# EasyEDA Pro project ProDoc_PSM_2025-08-30.epro, schematic PSM_SCH
Board Name: PSM; Create Date: 2025-08-29; Page Name: P1; Project Name: ICM module; Schematic Name: PSM_SCH; Update Date: 2025-08-30; Company: EasyEDA.com; Page Size: A4; Version: V1.0
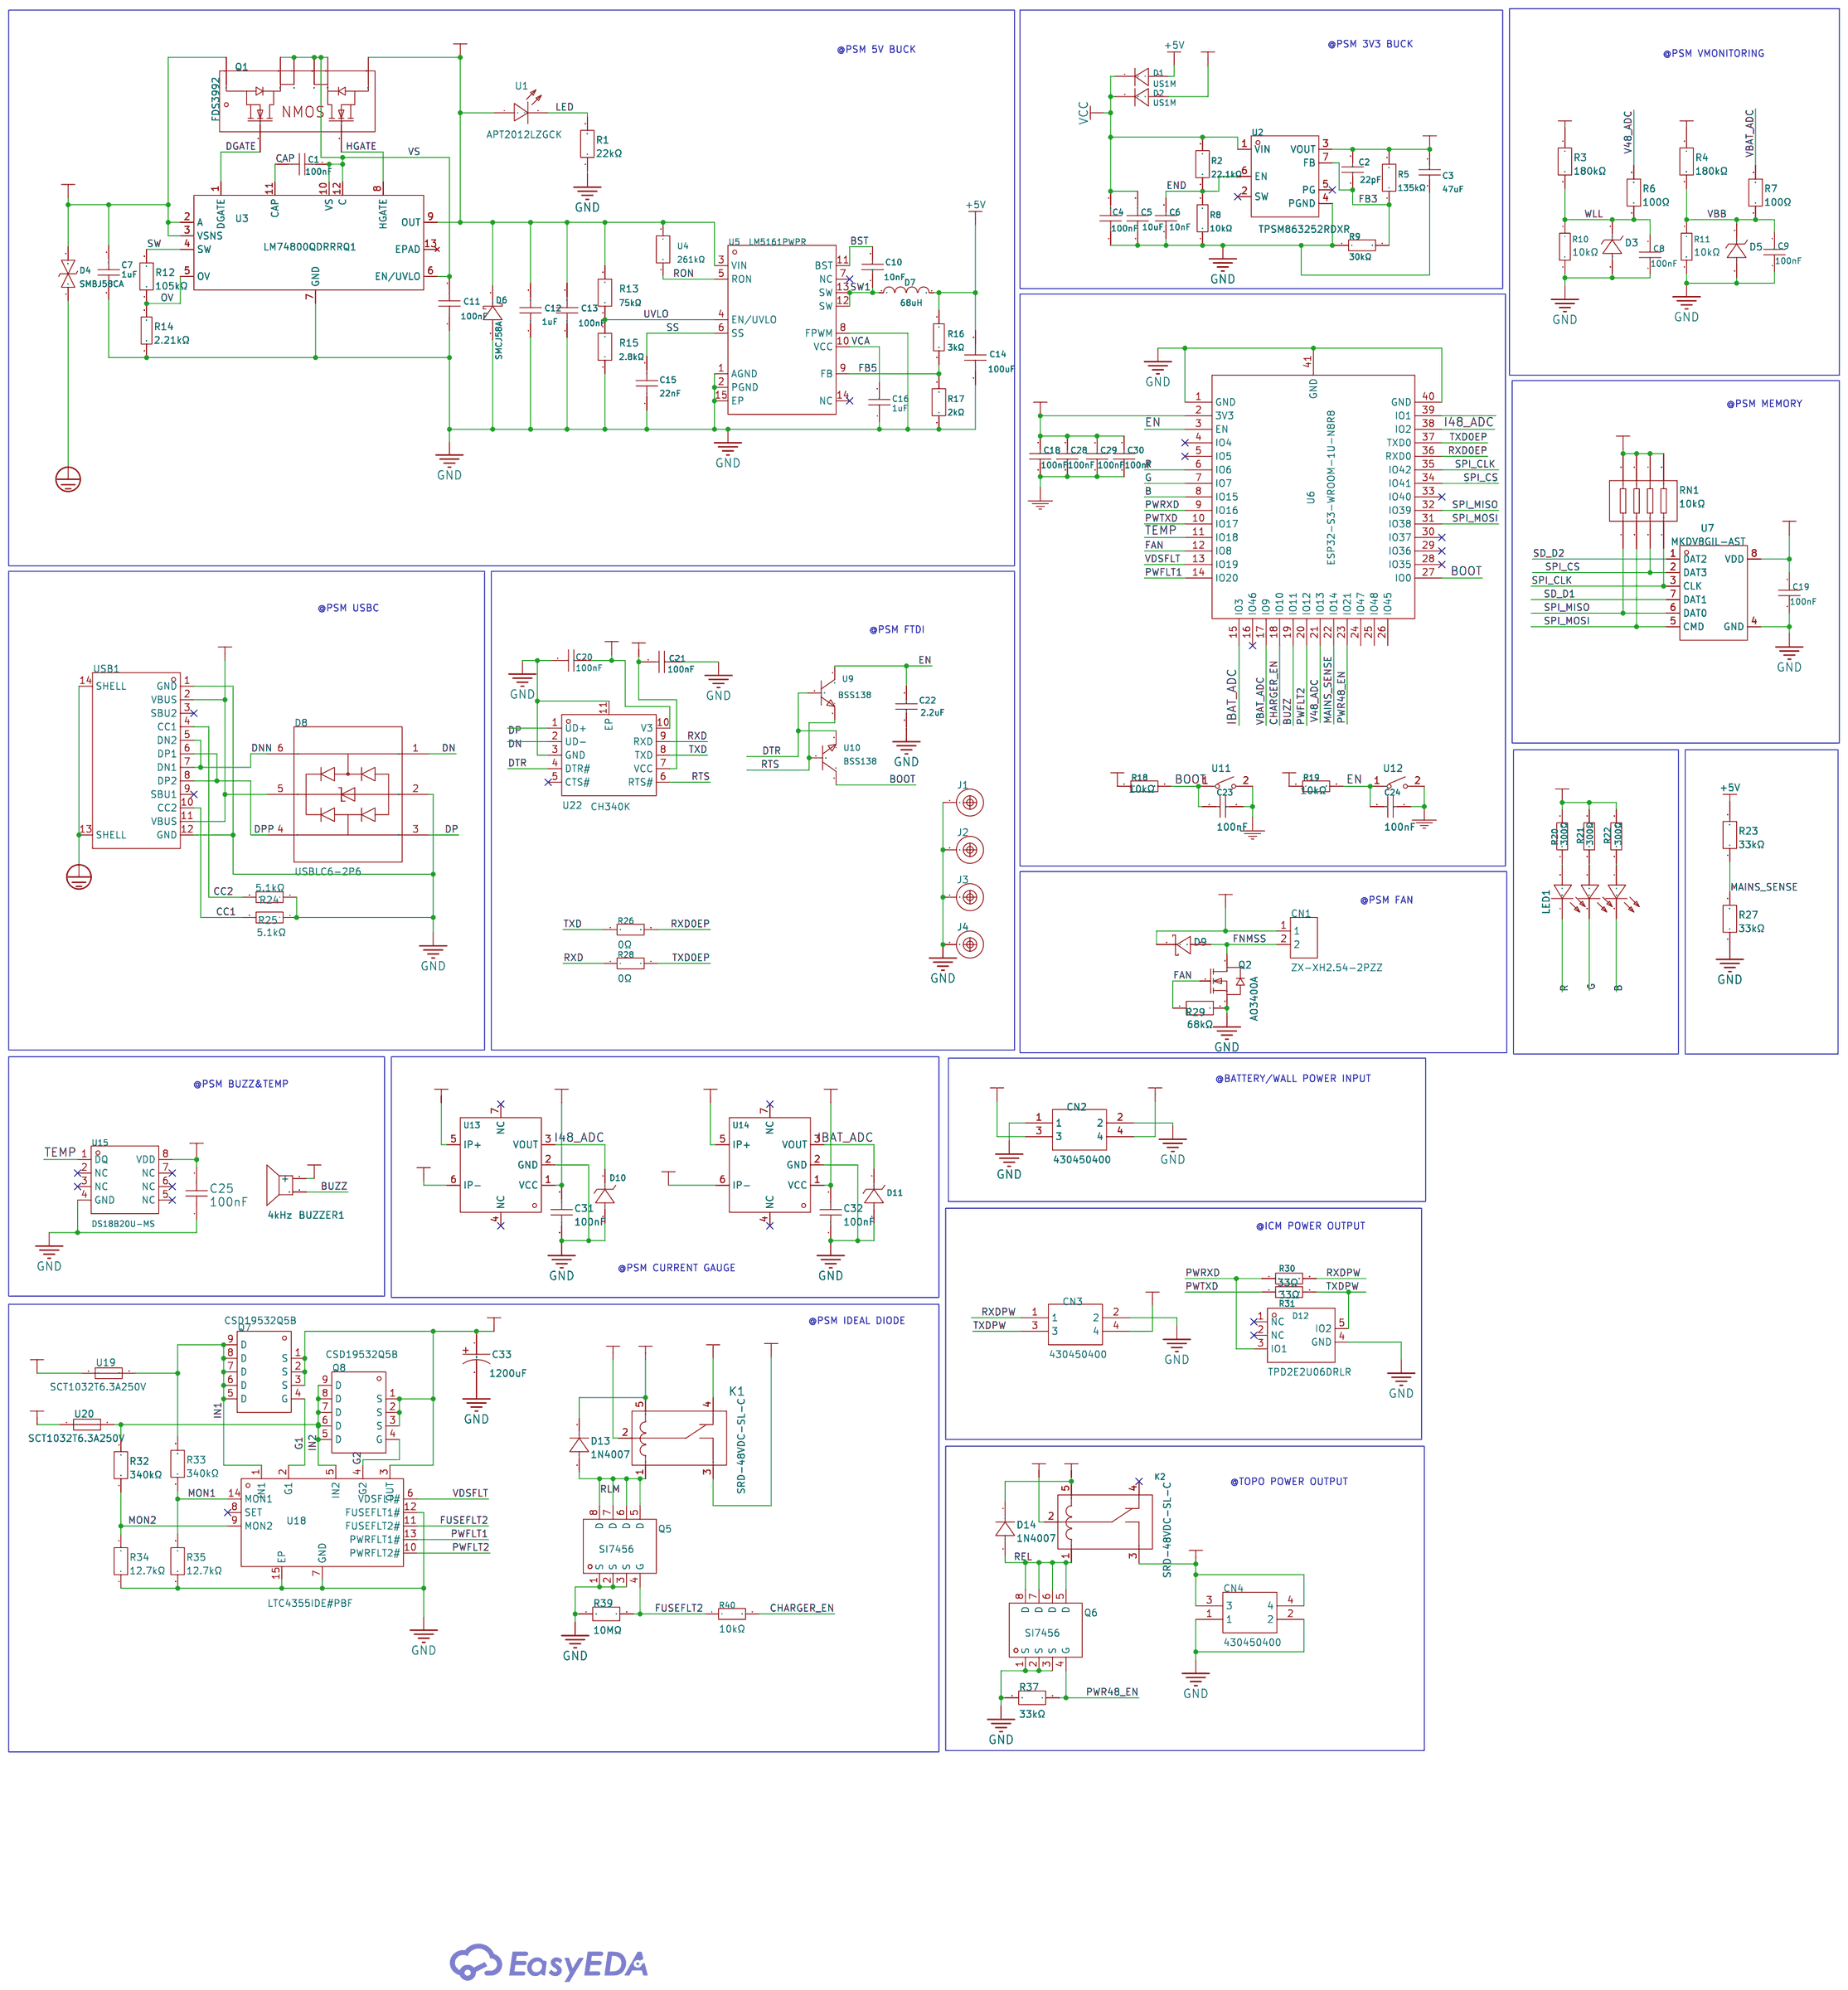
[diagram p0: schematic sheet]

## Parts
BUZZER1  4kHz  [BUZ-TH_PKM13EPYH4002-B0]
C1  100nF  [C1210]
C2  22pF  [C0201]
C3  47uF  [C1210]
C4  100nF  [C0402]
C5  10uF  [C0805]
C6  10nF  [C0201]
C7  1uF  [C2220]
C8  100nF  [C0805]
C9  100nF  [C0805]
C10  10nF  [C0402]
C11  100nF  [C1210]
C12  1uF  [C2220]
C13  100nF  [C1210]
C14  100uF  [C1210]
C15  22nF  [C0805]
C16  1uF  [C0603]
C18  100nF  [C0805]
C19  100nF  [C0805]
C20  100nF  [C0805]
C21  100nF  [C0805]
C22  2.2uF  [C0805]
C23  100nF  [C0805]
C24  100nF  [C0805]
C25  100nF  [C0805]
C28  100nF  [C0805]
C29  100nF  [C0805]
C30  100nF  [C0805]
C31  100nF  [C0805]
C32  100nF  [C0805]
C33  1200uF  [CAP-SMD_BD10.0-L10.3-W10.3-FD-LS11.0]
CN1  ZX-XH2.54-2PZZ  [CONN-TH_2P-P2.50_HX25003-2A]
CN2  430450400  [CONN-TH_0430450400]
CN3  430450400  [CONN-TH_0430450400]
CN4  430450400  [CONN-TH_0430450400]
D1  US1M  [SMA_L4.4-W2.8-LS5.4-RD]
D2  US1M  [SMA_L4.4-W2.8-LS5.4-RD]
D3  MMSZ5232B  [SOD-123_L2.7-W1.6-LS3.7-RD]
D4  SMBJ58CA  [SMB_L4.6-W3.6-LS5.3-BI]
D5  MMSZ5232B  [SOD-123_L2.7-W1.6-LS3.7-RD]
D6  SMCJ58A  [SMC_L6.9-W5.8-LS7.9-RD]
D7  68uH  [IND-SMD_L12.5-W12.5-SRR1280-150M]
D8  USBLC6-2P6  [SOT-666-6_L1.6-W1.2-P0.50-LS1.6-BR]
D9  BAT46WJ,115  [SOD-323F_L2.0-W1.6-LS2.5-RD]
D10  1SMA4728A  [SMA_L4.3-W2.6-LS5.0-RD]
D11  1SMA4728A  [SMA_L4.3-W2.6-LS5.0-RD]
D12  TPD2E2U06DRLR  [SOT-553-5_L1.6-W1.2-P0.50-LS1.6-TL-1]
D13  1N4007  [SMA_L4.3-W2.5-LS5.0-RD]
D14  1N4007  [SMA_L4.3-W2.5-LS5.0-RD]
J1  SCREW-MOUNTING-HOLE-3MM  [MountingHole:MountingHole_2.7mm_M2.5_Pad_Via]
J2  SCREW-MOUNTING-HOLE-3MM  [MountingHole:MountingHole_2.7mm_M2.5_Pad_Via]
J3  SCREW-MOUNTING-HOLE-3MM  [MountingHole:MountingHole_2.7mm_M2.5_Pad_Via]
J4  SCREW-MOUNTING-HOLE-3MM  [MountingHole:MountingHole_2.7mm_M2.5_Pad_Via]
K1  SRD-48VDC-SL-C  [RELAY-TH_SRD-48VDC-SL-C]
K2  SRD-48VDC-SL-C  [RELAY-TH_SRD-48VDC-SL-C]
LED1  HL-AF-5060H271BU46FU79GC-S1-THL  [LED-ARRAY-SMD_6P-L5.4-W5.0-TL-FD]
Q1  FDS3992  [SO-8_L4.9-W3.9-P1.27-LS5.9-BL]
Q2  AO3400A  [SOT-23-3_L2.9-W1.6-P1.90-LS2.8-BR]
Q5  SI7456  [POWERPAK-SO-8_L5.9-W4.9-P1.27-LS6.2-BL]
Q6  SI7456  [POWERPAK-SO-8_L5.9-W4.9-P1.27-LS6.2-BL]
Q7  CSD19532Q5B  [SON-8_L5.0-W6.0-P1.27-BL-1]
Q8  CSD19532Q5B  [SON-8_L5.0-W6.0-P1.27-BL-1]
R1  22kΩ  [R1210]
R2  22.1kΩ  [R0402]
R3  180kΩ  [R1206]
R4  180kΩ  [R1206]
R5  135kΩ  [R0603]
R6  100Ω  [R1206]
R7  100Ω  [R1206]
R8  10kΩ  [R0402]
R9  30kΩ  [R0603]
R10  10kΩ  [R1206]
R11  10kΩ  [R1206]
R12  105kΩ  [R1206]
R13  75kΩ  [R1210]
R14  2.21kΩ  [R1206]
R15  2.8kΩ  [R1210]
R16  3kΩ  [R0603]
R17  2kΩ  [R0402]
R18  10kΩ  [R0805]
R19  10kΩ  [R0805]
R20  300Ω  [R0805]
R21  300Ω  [R0805]
R22  300Ω  [R0805]
R23  33kΩ  [R1206]
R24  5.1kΩ  [R0805]
R25  5.1kΩ  [R0805]
R26  0Ω  [R0805]
R27  33kΩ  [R1206]
R28  0Ω  [R0805]
R29  68kΩ  [R1206]
R30  33Ω  [R0805]
R31  33Ω  [R0805]
R32  340kΩ  [R1206]
R33  340kΩ  [R1206]
R34  12.7kΩ  [R1206]
R35  12.7kΩ  [R1206]
R37  33kΩ  [R1206]
R39  10MΩ  [R1206]
R40  10kΩ  [R1206]
RN1  10kΩ  [RES-ARRAY-SMD_0603-8P-L3.2-W1.6-BL]
U1  APT2012LZGCK  [LED-SMD_L2.0-W1.3-R-RD]
U2  TPSM863252RDXR  [QFN-7_L4.0-W3.3_TPSM863257RDXR]
U3  LM74800QDRRRQ1  [WSON-12_L3.0-W3.0-P0.50-TL-EP-2]
U4  261kΩ  [R0402]
U5  LM5161PWPR  [HTSSOP-14_L5.0-W4.4-P0.65-LS6.4-BL-EP3.0]
U6  ESP32-S3-WROOM-1U-N8R8  [WIRELM-SMD_ESP32-S3-WROOM-1U]
U7  MKDV8GIL-AST  [LGA-8_L6.0-W8.0-P1.27-TL]
U9  BSS138  [SOT-23-3_L2.9-W1.6-P1.90-LS2.8-BR]
U10  BSS138  [SOT-23-3_L2.9-W1.6-P1.90-LS2.8-BR]
U11  TD-1183SN-1.7H-250  [KEY-SMD_L3.0-W2.5-LS4.0]
U12  TD-1183SN-1.7H-250  [KEY-SMD_L3.0-W2.5-LS4.0]
U13  ACS781LLRTR-100B-T  [PSOF-7_L6.4-W4.8-BL]
U14  ACS781LLRTR-100B-T  [PSOF-7_L6.4-W4.8-BL]
U15  DS18B20U-MS  [MSOP-8_L3.0-W3.0-P0.65-LS4.9-BL-1]
U18  LTC4355IDE#PBF  [DFN-14_L4.0-W3.0-P0.50-BL-EP]
U19  SCT1032T6.3A250V  [FUSE-SMD_L10.3-W3.3]
U20  SCT1032T6.3A250V  [FUSE-SMD_L10.3-W3.3]
U22  CH340K  [ESOP-10_L4.9-W3.9-P1.00-LS6.2-BL-EP]
USB1  TYPE-C 16PIN 2MD(073)  [USB-C-SMD_TYPE-C-6PIN-2MD-073]

## Library data of the parts
BUZZER1 = PKM13EPYH4002-B0: Driver Circuitry:Passive (external drive) Technology:Piezoelectric Voltage Rating:- Voltage - Supply:±15V Voltage - Supply:±15V Frequency:4kHz Current Consumption:- Sound Pressure Level(SPL):78dB Diameter(φD):12.6mm Length:- Width:- Height:7.4mm Operating; LCSC Part Name: 压电式蜂鸣器; Supplier Part: C128650; Manufacturer: muRata(村田); Supplier Footprint: 插件,D=12.6mm; JLCPCB Part Class: Extended Part; Datasheet: https://atta.szlcsc.com/upload/public/pdf/source/20200305/C492053_735FBBD713E87D0F645D81009B709975.pdf; Supplier: LCSC; Driver Circuitry: Passive (external drive); Technology: Piezoelectric; Voltage - Supply: ±15V; Sound Pressure Level(SPL): 78dB; Diameter(φD): 12.6mm; Height: 7.4mm; Operating Temperature: -40℃~+85℃
C1 C11 C13 = CC1210KKX7RYBB104: Capacitance: Tolerance:±10% Tolerance:±10% Voltage Rated: Temperature Coefficient:; LCSC Part Name: 100nF ±10% 250V; Supplier Part: C527381; Manufacturer: YAGEO(国巨); Supplier Footprint: 1210; JLCPCB Part Class: Extended Part; Datasheet: https://atta.szlcsc.com/upload/public/pdf/source/20200508/C527381_FB64CFF56C74B71B8CBBB2E2D2FF56B0.pdf; Supplier: LCSC; Tolerance: ±10%
C2 = GRM0335C1E220JA01D: Capacitance: Tolerance:±5% Tolerance:±5% Voltage Rated: Temperature Coefficient:; LCSC Part Name: 22pF ±5% 25V; Supplier Part: C76919; Manufacturer: muRata(村田); Supplier Footprint: 0201; JLCPCB Part Class: Extended Part; Datasheet: https://atta.szlcsc.com/upload/public/pdf/source/20180307/C76919_15204090858141407709.pdf; Supplier: LCSC; Tolerance: ±5%
C3 = GRM32ER71A476KE15L: Capacitance: Tolerance:±10% Tolerance:±10% Voltage Rated: Temperature Coefficient:; LCSC Part Name: 47uF ±10% 10V; Supplier Part: C84494; Manufacturer: muRata(村田); Supplier Footprint: 1210; JLCPCB Part Class: Extended Part; Datasheet: https://atta.szlcsc.com/upload/public/pdf/source/20161226/1482720144456.pdf; Supplier: LCSC; Tolerance: ±10%
C4 = GRM155R71A104KA01D: Capacitance: Tolerance:±10% Tolerance:±10% Voltage Rated: Temperature Coefficient:; LCSC Part Name: 100nF ±10% 10V; Supplier Part: C71687; Manufacturer: muRata(村田); Supplier Footprint: 0402; JLCPCB Part Class: Extended Part; Datasheet: https://atta.szlcsc.com/upload/public/pdf/source/20180228/C71687_15198055953951377607.pdf; Supplier: LCSC; Tolerance: ±10%
C5 = C0805C106K8PACTU: Capacitance: Tolerance:±10% Tolerance:±10% Voltage Rated: Temperature Coefficient:; LCSC Part Name: 10uF ±10% 10V; Supplier Part: C2167673; Manufacturer: KEMET(基美); Supplier Footprint: 0805; JLCPCB Part Class: Extended Part; Datasheet: https://atta.szlcsc.com/upload/public/pdf/source/20210601/F69F25D6FEA5EB3D7C122B835EA50B80.pdf; Supplier: LCSC; Tolerance: ±10%
C6 = GRM033R70J103KA01D: Capacitance: Tolerance:±10% Tolerance:±10% Voltage Rated: Temperature Coefficient:; LCSC Part Name: 10nF ±10% 6.3V; Supplier Part: C76940; Manufacturer: muRata(村田); Supplier Footprint: 0201; JLCPCB Part Class: Extended Part; Datasheet: https://atta.szlcsc.com/upload/public/pdf/source/20180307/C76940_15204091030811407728.pdf; Supplier: LCSC; Tolerance: ±10%
C7 C12 = GRM55DR72E105KW01L: Capacitance: Tolerance:±10% Tolerance:±10% Voltage Rated: Temperature Coefficient:; LCSC Part Name: 1uF ±10% 250V; Supplier Part: C489791; Manufacturer: muRata(村田); Supplier Footprint: 2220; JLCPCB Part Class: Extended Part; Datasheet: https://atta.szlcsc.com/upload/public/pdf/source/20200303/C489791_21819A01F8644F985297DAC22D62BF33.pdf; Supplier: LCSC; Tolerance: ±10%
C8 C9 C18-C21 C23 C24 C28-C30 = 0805B104K500NT: Capacitance:100nF Tolerance:±10% Tolerance:±10% Voltage Rated: Temperature Coefficient:; LCSC Part Name: 100nF ±10% 50V; Supplier Part: C38141; Manufacturer: FH(风华); Supplier Footprint: 0805; JLCPCB Part Class: Extended Part; Datasheet: https://atta.szlcsc.com/upload/public/pdf/source/20200305/C486355_26A10D38EF8C2A5C37091D0039909270.pdf; Supplier: LCSC; Tolerance: ±10%
C10 = GRM155R71H103KA88D: Capacitance: Tolerance:±10% Tolerance:±10% Voltage Rated: Temperature Coefficient:; LCSC Part Name: 10nF ±10% 50V; Supplier Part: C77019; Manufacturer: muRata(村田); Supplier Footprint: 0402; JLCPCB Part Class: Extended Part; Datasheet: https://atta.szlcsc.com/upload/public/pdf/source/20180326/C77019_6A3693CE1BCE757D6A8B7C99DAE1B441.pdf; Supplier: LCSC; Tolerance: ±10%
C14 = GRM32ER60J107ME20L_C88154: Capacitance: Tolerance:±20% Tolerance:±20% Voltage Rated: Temperature Coefficient:; LCSC Part Name: 100uF ±20% 6.3V; Supplier Part: C88154; Manufacturer: muRata(村田); Manufacturer Part: GRM32ER60J107ME20L; Supplier Footprint: 1210; JLCPCB Part Class: Extended Part; Datasheet: https://atta.szlcsc.com/upload/public/pdf/source/20170116/1484561244372.pdf; Supplier: LCSC; Tolerance: ±20%
C15 = CC0805KRX7R7BB223: Capacitance: Tolerance:±10% Tolerance:±10% Voltage Rated: Temperature Coefficient:; LCSC Part Name: 22nF ±10% 16V; Supplier Part: C519961; Manufacturer: YAGEO(国巨); Supplier Footprint: 0805; JLCPCB Part Class: Extended Part; Datasheet: https://atta.szlcsc.com/upload/public/pdf/source/20200423/C519961_BCF55CFF7AF7FA8FAC393D5C8451BEF7.pdf; Supplier: LCSC; Tolerance: ±10%
C16 = EMK107B7105KA-T: Capacitance:1uF Tolerance:±10% Tolerance:±10% Voltage Rating:16V Temperature Coefficient:X7R; LCSC Part Name: MSASE168SB7105KTNA01 1uF ±10% 16V; Supplier Part: C92759; Manufacturer: TAIYO YUDEN(太诱); Supplier Footprint: 0603; JLCPCB Part Class: Extended Part; Datasheet: https://item.szlcsc.com/datasheet/EMK107B7105KA-T/93953.html; Supplier: LCSC; Tolerance: ±10%; Voltage Rating: 16V; Temperature Coefficient: X7R
C22 = CL21B225KAFNNNE: Capacitance: Tolerance:±10% Tolerance:±10% Voltage Rated: Temperature Coefficient:; LCSC Part Name: 2.2uF ±10% 25V; Supplier Part: C19110; Manufacturer: SAMSUNG(三星); Supplier Footprint: 0805; JLCPCB Part Class: Extended Part; Datasheet: https://atta.szlcsc.com/upload/public/pdf/source/20160218/1457707763339.pdf; Supplier: LCSC; Tolerance: ±10%
C25 = GCM21BR71H104KA37K: Capacitance:0.1uF Tolerance:±10% Tolerance:±10% Voltage Rating:50V Temperature Coefficient:X7R; LCSC Part Name: 100nF ±10% 50V; Supplier Part: C28233; Manufacturer: muRata(村田); Supplier Footprint: 0805; JLCPCB Part Class: Extended Part; Datasheet: https://atta.szlcsc.com/upload/public/pdf/source/20230811/01F8D1403046F5B0772D3592B1B0BAA0.pdf; Supplier: LCSC; Tolerance: ±10%; Voltage Rating: 50V; Temperature Coefficient: X7R
C31 C32 = CC0805KRX7R9BB104: Capacitance:100nF Tolerance:±10% Tolerance:±10% Voltage Rating:50V Temperature Coefficient:X7R; LCSC Part Name: 100nF ±10% 50V; Supplier Part: C49678; Manufacturer: YAGEO(国巨); Supplier Footprint: 0805; JLCPCB Part Class: Basic Part; Datasheet: https://item.szlcsc.com/datasheet/CC0805KRX7R9BB104/50686.html; Supplier: LCSC; Tolerance: ±10%; Voltage Rating: 50V; Temperature Coefficient: X7R
C33 = OVZ122M0ETR-1008: Capacitance:1200uF Tolerance:±20% Tolerance:±20% Voltage Rating:2.5V Ripple Current:4.45A@100kHz Equivalent Series Resistance(ESR):- Type:- Pin Spacing:- Diameter:10mm Height - Seated (Max):7.7mm Lifetime:2000hrs@105℃ Operating Temperature:-55℃~+105℃ Oper; LCSC Part Name: 1200uF ±20% 2.5V; Supplier Part: C250090; Manufacturer: Lelon(立隆); Supplier Footprint: SMD,D10xL7.7mm; JLCPCB Part Class: Extended Part; Datasheet: https://item.szlcsc.com/datasheet/OVZ122M0ETR-1008/246212.html; Supplier: LCSC; Tolerance: ±20%; Voltage Rating: 2.5V; Ripple Current: 4.45A@100kHz; Diameter: 10mm; Height - Seated (Max): 7.7mm; Lifetime: 2000hrs@105℃; Operating Temperature: -55℃~+105℃
CN1 = ZX-XH2.54-2PZZ: Pins Structure:1x2P Pitch:2.5mm Mounting Type:Through Hole Reference Series:XH Number of Pins:2P Number of Rows:1 Number of PINs Per Row:2 Row Spacing:- Current Rating:3A Contact Material:Brass Contact Plating:Tin Operating Temperature:-25℃~+85℃ Operating; LCSC Part Name: 1x2P 间距:2.5mm 直插 系列:XH; Supplier Part: C7429632; Manufacturer: Megastar(兆星); Supplier Footprint: 插件,P=2.5mm; JLCPCB Part Class: Extended Part; Datasheet: https://item.szlcsc.com/datasheet/ZX-XH2.54-2PZZ/8427549.html; Supplier: LCSC; Pins Structure: 1x2P; Pitch: 2.5mm; Mounting Type: Through Hole; Reference Series: XH; Number of Pins: 2P; Number of Rows: 1; Number of PINs Per Row: 2; Current Rating: 3A; Contact Material: Brass; Contact Plating: Tin; Operating Temperature: -25℃~+85℃; Voltage Rating: 250V; Plastic Material: PA66; Flame Retardant Rating: UL94V-0; Color: White; Z-Height of the Board: 7mm; X-Length of Bottom Edge on Board (Spacing Line): 7.5mm; Y-Width of Bottom Edge on Board: 5.9mm
CN2-CN4 = 430450400_C122413: Pins Structure:2x2P Pitch:3mm Mounting Type:Right Angle Reference Series:Micro-Fit(MX 3.0) Number of Pins:4P Number of Rows:2 Number of PINs Per Row:2 Row Spacing:3mm Current Rating:8.5A Contact Material:Brass Contact Plating:Tin Operating Temperature:-40; LCSC Part Name: 2x2P 间距:3mm 弯插 系列:Micro-Fit(MX 3.0); Supplier Part: C122413; Manufacturer: MOLEX; Supplier Footprint: 弯插,P=3mm; JLCPCB Part Class: Extended Part; Datasheet: https://www.molex.com/content/dam/molex/molex-dot-com/products/automated/en-us/salesdrawingpdf/430/43045/430450400_sd.pdf?inline\; Supplier: LCSC; Pins Structure: 2x2P; Pitch: 3mm; Mounting Type: Right Angle; Reference Series: Micro-Fit(MX 3.0); Number of Pins: 4P; Number of Rows: 2; Number of PINs Per Row: 2; Row Spacing: 3mm; Current Rating: 8.5A; Contact Material: Brass; Contact Plating: Tin; Operating Temperature: -40℃~+105℃; Voltage Rating: 600V; Flame Retardant Rating: UL94V-0; Supplementary Features: Harpoon Contact (Plastic); Color: Black; Z-Height of the Board: 8.77mm; X-Length of Bottom Edge on Board (Spacing Line): 9.65mm; Y-Width of Bottom Edge on Board: 12.24mm
D1 D2 = US1M_C412437: Diode Configuration:Independent Type Forward Voltage (Vf@If):1.65V@1A Reverse Voltage (Vr): Rectified Current: Reverse Leakage Current:5uA@1kV Reverse Recovery Time (trr): Operating Temperature:-55℃~+150℃@(Tj) Operating Temperature:-55℃~+150℃@(Tj); LCSC Part Name: 电压:1kV 电流:1A; Supplier Part: C412437; Manufacturer: MDD(辰达半导体); Supplier Footprint: SMA; JLCPCB Part Class: Basic Part; Datasheet: https://atta.szlcsc.com/upload/public/pdf/source/20240710/67F2BD91F54C3EE0CEC9BDDD003BC3A0.pdf; Supplier: LCSC; Diode Configuration: Independent Type; Forward Voltage (Vf@If): 1.65V@1A; Reverse Leakage Current: 5uA@1kV; Operating Temperature: -55℃~+150℃@(Tj)
D3 D5 = MMSZ5232B_C19077423: Diode Configuration:Independent Zener Voltage(Nom):5.4V Reverse Leakage Current (Ir):5uA@3.0V Zener Voltage(Range):5.32V~5.88V Zener Voltage(Range):5.32V~5.88V Pd - Power Dissipation:500mW Impedance(Zzt):11Ω Operating Junction Temperature Range:-55℃~+150℃; LCSC Part Name: 独立式 耐压:5.4V 电流:5uA@3.0V; Supplier Part: C19077423; Manufacturer: 宏嘉诚; Supplier Footprint: SOD-123; JLCPCB Part Class: Extended Part; Datasheet: https://item.szlcsc.com/datasheet/MMSZ5232B/20275508.html; Supplier: LCSC; Diode Configuration: Independent; Zener Voltage(Nom): 5.4V; Reverse Leakage Current (Ir): 5uA@3.0V; Zener Voltage(Range): 5.32V~5.88V; Pd - Power Dissipation: 500mW; Impedance(Zzt): 11Ω; Operating Junction Temperature Range: -55℃~+150℃
D4 = SMBJ58CA_C440309: Polarity:Bidirectional Reverse Stand-Off Voltage (Vrwm):58V Clamping Voltage:93.6V Peak Pulse Current (Ipp):6.4A Peak Pulse Power Dissipation (Ppp):600W@10/1000us Voltage - Breakdown:64.4V Reverse Leakage Current (Ir):5uA Operating Temperature:-55℃~+150℃; LCSC Part Name: 双向TVS 58V截止 峰值浪涌电流：6.4A; Supplier Part: C440309; Manufacturer: AnBon(安邦); Supplier Footprint: SMB(DO-214AA); JLCPCB Part Class: Extended Part; Datasheet: https://item.szlcsc.com/datasheet/SMBJ58CA/439717.html; Supplier: LCSC; Polarity: Bidirectional; Reverse Stand-Off Voltage (Vrwm): 58V; Clamping Voltage: 93.6V; Peak Pulse Current (Ipp): 6.4A; Peak Pulse Power Dissipation (Ppp): 600W@10/1000us; Voltage - Breakdown: 64.4V; Reverse Leakage Current (Ir): 5uA; Operating Temperature: -55℃~+150℃; Type: TVS
D6 = SMCJ58A_C42371547: Polarity:Unidirectional Reverse Stand-Off Voltage (Vrwm):58V Clamping Voltage:93.6V Peak Pulse Current (Ipp):16.1A Peak Pulse Power Dissipation (Ppp):1.5kW Voltage - Breakdown:71.2V Reverse Leakage Current (Ir):1uA Operating Temperature:-55℃~+150℃ Operati; LCSC Part Name: 1500W 表面贴装瞬态电压抑制器; Supplier Part: C42371547; Manufacturer: 宏嘉诚; Supplier Footprint: SMC(DO-214AB); JLCPCB Part Class: Extended Part; Datasheet: https://item.szlcsc.com/datasheet/SMCJ58A/44252474.html; Supplier: LCSC; Polarity: Unidirectional; Reverse Stand-Off Voltage (Vrwm): 58V; Clamping Voltage: 93.6V; Peak Pulse Current (Ipp): 16.1A; Peak Pulse Power Dissipation (Ppp): 1.5kW; Voltage - Breakdown: 71.2V; Reverse Leakage Current (Ir): 1uA; Operating Temperature: -55℃~+150℃; level of protection: IEC 61000-4-2; Type: TVS
D7 = SRR1260-680M: Inductance:68uH Tolerance:±20% Tolerance:±20% Current Rating:2.1A Current - Saturation(Isat):2.1A DC Resistance(DCR):110mΩ Type:- Ratings:-; LCSC Part Name: 68uH ±20% 2.1A; Supplier Part: C2041353; Manufacturer: BOURNS; Supplier Footprint: SMD,12.5x12.5mm; JLCPCB Part Class: Extended Part; Datasheet: https://item.szlcsc.com/datasheet/SRR1260-680M/2132916.html; Supplier: LCSC; Tolerance: ±20%; Current Rating: 2.1A; Current - Saturation(Isat): 2.1A; DC Resistance(DCR): 110mΩ
D8 = USBLC6-2P6_C15999: polarity:Unidirectional Reverse Stand-Off Voltage (Vrwm):5.25V Maximum Clamping Voltage:17V Peak Pulse Current (Ipp):5A Breakdown Voltage:6V Number of Lines:Dual channel Type:ESD; LCSC Part Name: 单向ESD; Supplier Part: C15999; Manufacturer: ST(意法半导体); Supplier Footprint: SOT-666-6; JLCPCB Part Class: Extended Part; Datasheet: https://atta.szlcsc.com/upload/public/pdf/source/20140724/1457707160627.pdf; Supplier: LCSC; polarity: Unidirectional; Reverse Stand-Off Voltage (Vrwm): 5.25V; Maximum Clamping Voltage: 17V; Peak Pulse Current (Ipp): 5A; Breakdown Voltage: 6V; Number of Lines: Dual channel; Type: ESD
D9 = BAT46WJ,115: Forward Voltage (Vf@If):850mV@250mA Reverse Voltage (Vr):100V Average Rectified Current (Io):250mA Reverse Leakage Current (Ir):9uA@100V; LCSC Part Name: 电压:100V 电流:250mA; Supplier Part: C114696; Manufacturer: Nexperia(安世); Supplier Footprint: SOD-323F; JLCPCB Part Class: Extended Part; Datasheet: https://atta.szlcsc.com/upload/public/pdf/source/20170620/1497944776306.pdf; Supplier: LCSC; Forward Voltage (Vf@If): 850mV@250mA; Reverse Voltage (Vr): 100V; Average Rectified Current (Io): 250mA; Reverse Leakage Current (Ir): 9uA@100V
D10 D11 = 1SMA4728A_C523836: Zener Voltage (Nom):3.3V Reverse Leakage Current (Ir):100uA@1V Power Dissipation:1W; Supplier Part: C523836; Manufacturer: MDD; Supplier Footprint: SMA; JLCPCB Part Class: Extended Part; Datasheet: https://atta.szlcsc.com/upload/public/pdf/source/20230314/D3FB3E27E1B37F88B63DBD3F994A8ACA.pdf; Supplier: LCSC; Zener Voltage (Nom): 3.3V; Reverse Leakage Current (Ir): 100uA@1V; Power Dissipation: 1W
D12 = TPD2E2U06DRLR: Reverse Stand-Off Voltage (Vrwm):5.5V Clamping Voltage:12.4V Peak Pulse Current (Ipp):5.5A@8/20us Peak Pulse Power Dissipation (Ppp):85W@8/20us Voltage - Breakdown:6.5V Reverse Leakage Current (Ir):10nA Number of Channels:2 Operating Temperature:-40℃~+125; Supplier Part: C1972959; Manufacturer: TI(德州仪器); Supplier Footprint: SOT-553-5; JLCPCB Part Class: Extended Part; Datasheet: https://www.ti.com/cn/lit/gpn/tpd2e2u06; Supplier: LCSC; Reverse Stand-Off Voltage (Vrwm): 5.5V; Clamping Voltage: 12.4V; Peak Pulse Current (Ipp): 5.5A@8/20us; Peak Pulse Power Dissipation (Ppp): 85W@8/20us; Voltage - Breakdown: 6.5V; Reverse Leakage Current (Ir): 10nA; Number of Channels: 2; Operating Temperature: -40℃~+125℃; level of protection: IEC 61000-4-5；IEC 61000-4-2; Type: ESD; Junction Capacitance: 1.5pF
D13 D14 = 1N4007_C727081: Diode Configuration:Independent Voltage - Forward(Vf@If):1.1V@1A Voltage - DC Reverse(Vr):1kV Current - Rectified:1A Reverse Leakage Current (Ir):5uA; Supplier Part: C727081; Manufacturer: TWGMC(迪嘉); Supplier Footprint: SMA(DO-214AC); JLCPCB Part Class: Extended Part; Datasheet: https://item.szlcsc.com/datasheet/1N4007/774186.html; Supplier: LCSC; Diode Configuration: Independent; Voltage - Forward(Vf@If): 1.1V@1A; Voltage - DC Reverse(Vr): 1kV; Current - Rectified: 1A; Reverse Leakage Current (Ir): 5uA
J1-J4 = SCREW-MOUNTING-HOLE-3MM
K1 K2 = SRD-48VDC-SL-C: Coil Voltage:48V Contact Form:1 Form C: 1C (SPDT-CO) Number of Pins:5 Contact Rating:- Switching Voltage(Max):250V@AC Coil Rated Power:360mW Switching Current(Max):15A Coil Type:Non-Polarized - Single Coil Coil Resistance:6.4kΩ Contact Resistance:100mΩ Op; LCSC Part Name: 蓝色 单组转换型继电器; Supplier Part: C490149; Manufacturer: 松乐; Supplier Footprint: 插件,15.6x19.2mm; JLCPCB Part Class: Extended Part; Datasheet: https://item.szlcsc.com/datasheet/SRD-48VDC-SL-C/500431.html; Supplier: LCSC; Coil Voltage: 48V; Contact Form: 1 Form C: 1C (SPDT-CO); Number of Pins: 5; Switching Voltage(Max): 250V@AC; Coil Rated Power: 360mW; Switching Current(Max): 15A; Coil Type: Non-Polarized - Single Coil; Coil Resistance: 6.4kΩ; Contact Resistance: 100mΩ; Operate Time: 10ms; Release Time: 10ms
LED1 = HL-AF-5060H271BU46FU79GC-S1-THL: Supplier Part: C219409; Manufacturer: HONGLITRONIC(鸿利光电); Supplier Footprint: SMD5050; JLCPCB Part Class: Extended Part; Datasheet: https://atta.szlcsc.com/upload/public/pdf/source/20180503/C219409_0CFE42153F672A4C05B1C40D14E85291.pdf; Supplier: LCSC
Q1 = FDS3992: Number:2 N-Channel Drain to Source Voltage:100V Current - Continuous Drain(Id):4.5A RDS(on):- Pd - Power Dissipation:2.5W Gate Threshold Voltage (Vgs(th)):2V Gate Charge(Qg):11nC@10V Input Capacitance(Ciss):750pF@25V Reverse Transfer Capacitance (Crss@Vds; LCSC Part Name: 2个N沟道 耐压:100V 电流:4.5A; Supplier Part: C512899; Manufacturer: onsemi(安森美); Supplier Footprint: SO-8; JLCPCB Part Class: Extended Part; Datasheet: https://item.szlcsc.com/datasheet/FDS3992/527575.html; Supplier: LCSC; Number: 2 N-Channel; Drain to Source Voltage: 100V; Current - Continuous Drain(Id): 4.5A; Pd - Power Dissipation: 2.5W; Gate Threshold Voltage (Vgs(th)): 2V; Gate Charge(Qg): 11nC@10V; Input Capacitance(Ciss): 750pF@25V; Reverse Transfer Capacitance (Crss@Vds): 27pF@25V; Operating Temperature: -55℃~+150℃
Q2 = AO3400A_C5379092: Type:1 N-Channel Drain Source Voltage (Vdss): Continuous Drain Current (Id): Drain Source On Resistance (RDS(on)@Vgs,Id):20mΩ@10V,5A Power Dissipation (Pd): Gate Threshold Voltage (Vgs(th)@Id):1.2V@250uA Total Gate Charge (Qg@Vgs):4.1nC@10V Input Capacita; LCSC Part Name: 1个N沟道 耐压:30V 电流:5.8A; Supplier Part: C5379092; Manufacturer: MSKSEMI(美森科); Supplier Footprint: SOT-23-3L; JLCPCB Part Class: Extended Part; Datasheet: https://atta.szlcsc.com/upload/public/pdf/source/20241113/12FF27F8B99F921F6260393F7E001EE2.pdf; Supplier: LCSC; Type: 1 N-Channel; Drain Source On Resistance (RDS(on)@Vgs,Id): 20mΩ@10V,5A; Gate Threshold Voltage (Vgs(th)@Id): 1.2V@250uA; Total Gate Charge (Qg@Vgs): 4.1nC@10V; Input Capacitance (Ciss@Vds): 345pF@25V; Reverse Transfer Capacitance (Crss@Vds): 32pF@25V; Operating Temperature: -55℃~+150℃
Q5 Q6 = SI7456DP-T1-GE3: Type:1 N-channel Drain to Source Voltage:100V Current - Continuous Drain(Id):9.3A RDS(on):0.025Ω@10V,9.3A Pd - Power Dissipation:5.2W Gate Threshold Voltage (Vgs(th)@Id):4V Gate Charge(Qg):44nC@10V Input Capacitance(Ciss@Vds):- Reverse Transfer Capacitanc; LCSC Part Name: 1个N沟道 耐压:100V 电流:9.3A 停产; Supplier Part: C141541; Manufacturer: VISHAY(威世); Supplier Footprint: PowerPAK-SO-8; JLCPCB Part Class: Extended Part; Datasheet: https://atta.szlcsc.com/upload/public/pdf/source/20171123/C141541_15114109284191137536.pdf; Supplier: LCSC; Type: 1 N-channel; Drain to Source Voltage: 100V; Current - Continuous Drain(Id): 9.3A; RDS(on): 0.025Ω@10V,9.3A; Pd - Power Dissipation: 5.2W; Gate Threshold Voltage (Vgs(th)@Id): 4V; Gate Charge(Qg): 44nC@10V; Reverse Transfer Capacitance (Crss@Vds): 8.6pF@50V; Operating Temperature: -55℃~+150℃
Q7 Q8 = CSD19532Q5B: Number:- Drain to Source Voltage:100V Current - Continuous Drain(Id):17A RDS(on):4.6mΩ@6V,17A Pd - Power Dissipation:195W Gate Threshold Voltage (Vgs(th)):2.6V Gate Charge(Qg):48nC@10V Input Capacitance(Ciss):4.81nF@50V Reverse Transfer Capacitance (Crss@; LCSC Part Name: 耐压:100V 电流:17A; Supplier Part: C473333; Manufacturer: TI(德州仪器); Supplier Footprint: SON-8(5x6); JLCPCB Part Class: Extended Part; Datasheet: https://www.ti.com/cn/lit/gpn/csd19532q5b; Supplier: LCSC; Drain to Source Voltage: 100V; Current - Continuous Drain(Id): 17A; RDS(on): 4.6mΩ@6V,17A; Pd - Power Dissipation: 195W; Gate Threshold Voltage (Vgs(th)): 2.6V; Gate Charge(Qg): 48nC@10V; Input Capacitance(Ciss): 4.81nF@50V; Reverse Transfer Capacitance (Crss@Vds): 18pF@50V; Operating Temperature: -55℃~+150℃
R1 = AC1210FR-0722KL: Type:Thick Film Resistor Resistance:22kΩ Tolerance:±1% Tolerance:±1% Power(Watts):500mW Voltage-Supply(Max):200V Temperature Coefficient:±100ppm/℃ Temperature Coefficient:±100ppm/℃ Operating Temperature:-55℃~+155℃ Operating Temperature:-55℃~+155℃; LCSC Part Name: 厚膜电阻 22kΩ ±1% 500mW; Supplier Part: C230119; Manufacturer: YAGEO(国巨); Supplier Footprint: 1210; JLCPCB Part Class: Extended Part; Datasheet: https://atta.szlcsc.com/upload/public/pdf/source/20241120/4D446B3946E6DC27047BD586A1D384B4.pdf; Supplier: LCSC; Type: Thick Film Resistor; Tolerance: ±1%; Power(Watts): 500mW; Voltage-Supply(Max): 200V; Temperature Coefficient: ±100ppm/℃; Operating Temperature: -55℃~+155℃
R2 = CRCW040222K1FKED: Type:Thick Film Resistors Resistance:22.1kΩ Tolerance:±1% Tolerance:±1% Power(Watts):62.5mW Voltage-Supply(Max):50V Temperature Coefficient:±100ppm/℃ Temperature Coefficient:±100ppm/℃ Operating Temperature:-55℃~+155℃ Operating Temperature:-55℃~+155℃; LCSC Part Name: 厚膜电阻 22.1kΩ ±1% 62.5mW; Supplier Part: C844504; Manufacturer: VISHAY(威世); Supplier Footprint: 0402; JLCPCB Part Class: Extended Part; Datasheet: https://atta.szlcsc.com/upload/public/pdf/source/20200927/C844919_23E7F5DF28E9421F105631C5C2D28736.pdf; Supplier: LCSC; Type: Thick Film Resistors; Tolerance: ±1%; Power(Watts): 62.5mW; Voltage-Supply(Max): 50V; Temperature Coefficient: ±100ppm/℃; Operating Temperature: -55℃~+155℃
R3 R4 = FRC1206J184 TS: Type:Thick Film Resistor Resistance:180kΩ Tolerance:±5% Tolerance:±5% Power(Watts):250mW Voltage-Supply(Max):200V Temperature Coefficient:±100ppm/℃ Temperature Coefficient:±100ppm/℃ Operating Temperature:-55℃~+155℃ Operating Temperature:-55℃~+155℃; LCSC Part Name: 180kΩ ±5% 250mW 厚膜电阻; Supplier Part: C2907436; Manufacturer: FOJAN(富捷); Supplier Footprint: 1206; JLCPCB Part Class: Extended Part; Datasheet: https://item.szlcsc.com/datasheet/FRC1206J184%2520TS/3180949.html; Supplier: LCSC; Type: Thick Film Resistor; Tolerance: ±5%; Power(Watts): 250mW; Voltage-Supply(Max): 200V; Temperature Coefficient: ±100ppm/℃; Operating Temperature: -55℃~+155℃
R5 = RT0603BRD07135KL: Type:Thin Film Resistor Resistance: Tolerance:±0.1% Tolerance:±0.1% Power(Watts): Temperature Coefficient:±25ppm/℃ Temperature Coefficient:±25ppm/℃ Operating Temperature Range:-55℃~+155℃ Operating Temperature Range:-55℃~+155℃; LCSC Part Name: 薄膜电阻 135kΩ ±0.1% 100mW; Supplier Part: C861113; Manufacturer: YAGEO(国巨); Supplier Footprint: 0603; JLCPCB Part Class: Extended Part; Datasheet: https://atta.szlcsc.com/upload/public/pdf/source/20200610/C326738_5639A9F1B6EB6E4AE2197577D3456E7F.pdf; Supplier: LCSC; Type: Thin Film Resistor; Tolerance: ±0.1%; Temperature Coefficient: ±25ppm/℃; Operating Temperature Range: -55℃~+155℃
R6 R7 = FRC1206J101 TS: Type:Thick Film Resistor Resistance:100Ω Tolerance:±5% Tolerance:±5% Power(Watts):250mW Voltage-Supply(Max):200V Temperature Coefficient:±100ppm/℃ Temperature Coefficient:±100ppm/℃ Operating Temperature:-55℃~+155℃ Operating Temperature:-55℃~+155℃; LCSC Part Name: 100Ω ±5% 250mW 厚膜电阻; Supplier Part: C2907422; Manufacturer: FOJAN(富捷); Supplier Footprint: 1206; JLCPCB Part Class: Extended Part; Datasheet: https://item.szlcsc.com/datasheet/FRC1206J101%2520TS/3180935.html; Supplier: LCSC; Type: Thick Film Resistor; Tolerance: ±5%; Power(Watts): 250mW; Voltage-Supply(Max): 200V; Temperature Coefficient: ±100ppm/℃; Operating Temperature: -55℃~+155℃
R8 = CRCW040210K0FKED: Type:Thick Film Resistors Resistance:10kΩ Tolerance:±1% Tolerance:±1% Power(Watts):63mW Voltage-Supply(Max):50V Temperature Coefficient:±100ppm/℃ Temperature Coefficient:±100ppm/℃ Operating Temperature:-55℃~+155℃ Operating Temperature:-55℃~+155℃; LCSC Part Name: 厚膜电阻 10kΩ ±1% 63mW; Supplier Part: C71617; Manufacturer: VISHAY(威世); Supplier Footprint: 0402; JLCPCB Part Class: Extended Part; Datasheet: https://atta.szlcsc.com/upload/public/pdf/source/20180420/C190124_A776A444B598E5893D919B5902899056.pdf; Supplier: LCSC; Type: Thick Film Resistors; Tolerance: ±1%; Power(Watts): 63mW; Voltage-Supply(Max): 50V; Temperature Coefficient: ±100ppm/℃; Operating Temperature: -55℃~+155℃
R9 = RC0603FR-0730KL: Type:Thick Film Resistor Resistance:30kΩ Tolerance:±1% Tolerance:±1% Power(Watts):100mW Voltage-Supply(Max):75V Temperature Coefficient:±100ppm/℃ Temperature Coefficient:±100ppm/℃ Operating Temperature:-55℃~+155℃ Operating Temperature:-55℃~+155℃; LCSC Part Name: 厚膜电阻 30kΩ ±1% 100mW; Supplier Part: C100001; Manufacturer: YAGEO(国巨); Supplier Footprint: 0603; JLCPCB Part Class: Extended Part; Datasheet: https://atta.szlcsc.com/upload/public/pdf/source/20250610/89E4D743C004A82A45145C7A2CC3A578.pdf; Supplier: LCSC; Type: Thick Film Resistor; Tolerance: ±1%; Power(Watts): 100mW; Voltage-Supply(Max): 75V; Temperature Coefficient: ±100ppm/℃; Operating Temperature: -55℃~+155℃
R10 R11 R40 = 1206W4F1002T5E: Type:Thick Film Resistor Resistance:10kΩ Tolerance:±1% Tolerance:±1% Power(Watts):250mW Voltage-Supply(Max):200V Temperature Coefficient:±100ppm/℃ Temperature Coefficient:±100ppm/℃ Operating Temperature:-55℃~+155℃ Operating Temperature:-55℃~+155℃; LCSC Part Name: 10kΩ ±1% 250mW 厚膜电阻; Supplier Part: C17902; Manufacturer: UNI-ROYAL(厚声); Supplier Footprint: 1206; JLCPCB Part Class: Basic Part; Datasheet: https://item.szlcsc.com/datasheet/1206W4F1002T5E/18590.html; Supplier: LCSC; Type: Thick Film Resistor; Tolerance: ±1%; Power(Watts): 250mW; Voltage-Supply(Max): 200V; Temperature Coefficient: ±100ppm/℃; Operating Temperature: -55℃~+155℃
R12 = RC1206FR-07105KL: Type:Thick Film Resistor Resistance:105kΩ Tolerance:±1% Tolerance:±1% Power(Watts):250mW Voltage-Supply(Max):200V Temperature Coefficient:±100ppm/℃ Temperature Coefficient:±100ppm/℃ Operating Temperature:-55℃~+155℃ Operating Temperature:-55℃~+155℃; LCSC Part Name: 厚膜电阻 105kΩ ±1% 250mW; Supplier Part: C488616; Manufacturer: YAGEO(国巨); Supplier Footprint: 1206; JLCPCB Part Class: Extended Part; Datasheet: https://atta.szlcsc.com/upload/public/pdf/source/20250610/89E4D743C004A82A45145C7A2CC3A578.pdf; Supplier: LCSC; Type: Thick Film Resistor; Tolerance: ±1%; Power(Watts): 250mW; Voltage-Supply(Max): 200V; Temperature Coefficient: ±100ppm/℃; Operating Temperature: -55℃~+155℃
R13 = AC1210FR-0775KL: Type:Thick Film Resistors Resistance: Tolerance:±1% Tolerance:±1% Power(Watts): Overload Voltage (Max): Temperature Coefficient:±100ppm/℃ Temperature Coefficient:±100ppm/℃ Operating Temperature Range:-55℃~+155℃ Operating Temperature Range:-55℃~+155℃; LCSC Part Name: 厚膜电阻 75kΩ ±1% 500mW; Supplier Part: C230340; Manufacturer: YAGEO(国巨); Supplier Footprint: 1210; JLCPCB Part Class: Extended Part; Datasheet: https://atta.szlcsc.com/upload/public/pdf/source/20191108/C230504_7FB43CAE7E86B3B2980C2491161B254C.pdf; Supplier: LCSC; Type: Thick Film Resistors; Tolerance: ±1%; Temperature Coefficient: ±100ppm/℃; Operating Temperature Range: -55℃~+155℃
R14 = AC1206FR-072K21L: Type:Thick Film Resistors Resistance: Tolerance:±1% Tolerance:±1% Power(Watts):250mW Overload Voltage (Max): Temperature Coefficient:±100ppm/℃ Temperature Coefficient:±100ppm/℃ Operating Temperature Range:-55℃~+155℃ Operating Temperature Range:-55℃~+155℃; LCSC Part Name: 厚膜电阻 2.21kΩ ±1% 250mW; Supplier Part: C229508; Manufacturer: YAGEO(国巨); Supplier Footprint: 1206; JLCPCB Part Class: Extended Part; Datasheet: https://atta.szlcsc.com/upload/public/pdf/source/20180927/C229861_4ABDC471507C1ED6AFB4BA66AFC8620A.pdf; Supplier: LCSC; Type: Thick Film Resistors; Tolerance: ±1%; Power(Watts): 250mW; Temperature Coefficient: ±100ppm/℃; Operating Temperature Range: -55℃~+155℃
R15 = AC1210FR-072K8L: Type:Thick Film Resistors Resistance: Tolerance:±1% Tolerance:±1% Power(Watts): Overload Voltage (Max): Temperature Coefficient:±100ppm/℃ Temperature Coefficient:±100ppm/℃ Operating Temperature Range:-55℃~+155℃ Operating Temperature Range:-55℃~+155℃; LCSC Part Name: 厚膜电阻 2.8kΩ ±1% 500mW; Supplier Part: C230171; Manufacturer: YAGEO(国巨); Supplier Footprint: 1210; JLCPCB Part Class: Extended Part; Datasheet: https://atta.szlcsc.com/upload/public/pdf/source/20191108/C230504_7FB43CAE7E86B3B2980C2491161B254C.pdf; Supplier: LCSC; Type: Thick Film Resistors; Tolerance: ±1%; Temperature Coefficient: ±100ppm/℃; Operating Temperature Range: -55℃~+155℃
R16 = RC0603FR-073KL: Type:Thick Film Resistors Resistance:3kΩ Tolerance:±1% Tolerance:±1% Power(Watts):100mW Voltage-Supply(Max):75V Temperature Coefficient:±100ppm/℃ Temperature Coefficient:±100ppm/℃ Operating Temperature:-55℃~+155℃ Operating Temperature:-55℃~+155℃; LCSC Part Name: 厚膜电阻 3kΩ ±1% 100mW; Supplier Part: C126358; Manufacturer: YAGEO(国巨); Supplier Footprint: 0603; JLCPCB Part Class: Extended Part; Datasheet: https://atta.szlcsc.com/upload/public/pdf/source/20170914/C127450_1505359406912967677.pdf; Supplier: LCSC; Type: Thick Film Resistors; Tolerance: ±1%; Power(Watts): 100mW; Voltage-Supply(Max): 75V; Temperature Coefficient: ±100ppm/℃; Operating Temperature: -55℃~+155℃
R17 = CRCW04022K00FKED: Type:Thick Film Resistors Resistance: Tolerance:±1% Tolerance:±1% Power(Watts): Overload Voltage (Max): Temperature Coefficient:±100ppm/℃ Temperature Coefficient:±100ppm/℃ Operating Temperature Range:-55℃~+155℃ Operating Temperature Range:-55℃~+155℃; LCSC Part Name: 厚膜电阻 2kΩ ±1% 62.5mW; Supplier Part: C482125; Manufacturer: VISHAY(威世); Supplier Footprint: 0402; JLCPCB Part Class: Extended Part; Datasheet: https://atta.szlcsc.com/upload/public/pdf/source/20200618/C481956_E25174B008CE8C884BEDD7D4D15E674F.pdf; Supplier: LCSC; Type: Thick Film Resistors; Tolerance: ±1%; Temperature Coefficient: ±100ppm/℃; Operating Temperature Range: -55℃~+155℃
R18 R19 = 0805W8F1002T5E: Type:Thick Film Resistors Resistance:10kΩ Tolerance:±1% Tolerance:±1% Power(Watts): Overload Voltage (Max): Temperature Coefficient:±100ppm/℃ Temperature Coefficient:±100ppm/℃ Operating Temperature Range:-55℃~+155℃ Operating Temperature Range:-55℃~+155℃; LCSC Part Name: 10kΩ ±1% 125mW 厚膜电阻; Supplier Part: C17414; Manufacturer: UNI-ROYAL(厚声); Supplier Footprint: 0805; JLCPCB Part Class: Basic Part; Datasheet: https://atta.szlcsc.com/upload/public/pdf/source/20200306/C422600_1E6D84923E4A46A82E41ADD87F860B5C.pdf; Supplier: LCSC; Type: Thick Film Resistors; Tolerance: ±1%; Temperature Coefficient: ±100ppm/℃; Operating Temperature Range: -55℃~+155℃
R20-R22 = 0805W8F3000T5E: Type:Thick Film Resistor Resistance:300Ω Tolerance:±1% Tolerance:±1% Power(Watts):125mW Voltage-Supply(Max):150V Temperature Coefficient:±100ppm/℃ Temperature Coefficient:±100ppm/℃ Operating Temperature:-55℃~+155℃ Operating Temperature:-55℃~+155℃; LCSC Part Name: 300Ω ±1% 125mW 厚膜电阻; Supplier Part: C17617; Manufacturer: UNI-ROYAL(厚声); Supplier Footprint: 0805; JLCPCB Part Class: Basic Part; Datasheet: https://item.szlcsc.com/datasheet/0805W8F3000T5E/18305.html; Supplier: LCSC; Type: Thick Film Resistor; Tolerance: ±1%; Power(Watts): 125mW; Voltage-Supply(Max): 150V; Temperature Coefficient: ±100ppm/℃; Operating Temperature: -55℃~+155℃
R23 R27 R37 = FRC1206F3302TS: Type:Thick Film Resistor Resistance:33kΩ Tolerance:±1% Tolerance:±1% Power(Watts):250mW Voltage-Supply(Max):200V Temperature Coefficient:±100ppm/℃ Temperature Coefficient:±100ppm/℃ Operating Temperature:-55℃~+155℃ Operating Temperature:-55℃~+155℃; LCSC Part Name: 33kΩ ±1% 250mW 厚膜电阻; Supplier Part: C2933676; Manufacturer: FOJAN(富捷); Supplier Footprint: 1206; JLCPCB Part Class: Extended Part; Datasheet: https://item.szlcsc.com/datasheet/FRC1206F3302TS/3279778.html; Supplier: LCSC; Type: Thick Film Resistor; Tolerance: ±1%; Power(Watts): 250mW; Voltage-Supply(Max): 200V; Temperature Coefficient: ±100ppm/℃; Operating Temperature: -55℃~+155℃
R24 R25 = 0805W8F5101T5E: Type:Thick Film Resistor Resistance:5.1kΩ Tolerance:±1% Tolerance:±1% Power(Watts):125mW Voltage-Supply(Max):150V Temperature Coefficient:±100ppm/℃ Temperature Coefficient:±100ppm/℃ Operating Temperature:-55℃~+155℃ Operating Temperature:-55℃~+155℃; LCSC Part Name: 5.1kΩ ±1% 125mW 厚膜电阻; Supplier Part: C27834; Manufacturer: UNI-ROYAL(厚声); Supplier Footprint: 0805; JLCPCB Part Class: Basic Part; Datasheet: https://item.szlcsc.com/datasheet/0805W8F5101T5E/28584.html; Supplier: LCSC; Type: Thick Film Resistor; Tolerance: ±1%; Power(Watts): 125mW; Voltage-Supply(Max): 150V; Temperature Coefficient: ±100ppm/℃; Operating Temperature: -55℃~+155℃
R26 R28 = 0805W8F0000T5E_C17477: Type:Thick Film Resistors Resistance: Tolerance:±1% Tolerance:±1% Power(Watts): Overload Voltage (Max): Temperature Coefficient:±800ppm/℃ Temperature Coefficient:±800ppm/℃ Operating Temperature Range:-55℃~+155℃ Operating Temperature Range:-55℃~+155℃; LCSC Part Name: 0Ω ±1% 125mW 厚膜电阻; Supplier Part: C17477; Manufacturer: UNI-ROYAL(厚声); Manufacturer Part: 0805W8F0000T5E; Supplier Footprint: 0805; JLCPCB Part Class: Basic Part; Datasheet: https://atta.szlcsc.com/upload/public/pdf/source/20200306/C422600_1E6D84923E4A46A82E41ADD87F860B5C.pdf; Supplier: LCSC; Type: Thick Film Resistors; Tolerance: ±1%; Temperature Coefficient: ±800ppm/℃; Operating Temperature Range: -55℃~+155℃
R29 = RT1206BRD0768KL: Type:Thin Film Resistor Resistance: Tolerance:±0.1% Tolerance:±0.1% Power(Watts):250mW Overload Voltage (Max): Temperature Coefficient:±25ppm/℃ Temperature Coefficient:±25ppm/℃ Operating Temperature Range:-55℃~+155℃ Operating Temperature Range:-55℃~+155℃; LCSC Part Name: 薄膜电阻 68kΩ ±0.1% 250mW; Supplier Part: C706422; Manufacturer: YAGEO(国巨); Supplier Footprint: 1206; JLCPCB Part Class: Extended Part; Datasheet: https://atta.szlcsc.com/upload/public/pdf/source/20200720/C706422_759B829B0D18A4900E8B43DA140C33CB.pdf; Supplier: LCSC; Type: Thin Film Resistor; Tolerance: ±0.1%; Power(Watts): 250mW; Temperature Coefficient: ±25ppm/℃; Operating Temperature Range: -55℃~+155℃
R30 R31 = 0805W8F330JT5E: Type:Thick Film Resistor Resistance:33Ω Tolerance:±1% Tolerance:±1% Power(Watts):125mW Voltage-Supply(Max):150V Temperature Coefficient:±200ppm/℃ Temperature Coefficient:±200ppm/℃ Operating Temperature:-55℃~+155℃ Operating Temperature:-55℃~+155℃; LCSC Part Name: 33Ω ±1% 125mW 厚膜电阻; Supplier Part: C17634; Manufacturer: UNI-ROYAL(厚声); Supplier Footprint: 0805; JLCPCB Part Class: Basic Part; Datasheet: https://item.szlcsc.com/datasheet/0805W8F330JT5E/18322.html; Supplier: LCSC; Type: Thick Film Resistor; Tolerance: ±1%; Power(Watts): 125mW; Voltage-Supply(Max): 150V; Temperature Coefficient: ±200ppm/℃; Operating Temperature: -55℃~+155℃
R32 R33 = ARG06DTC3403: Type:Thin Film Resistor Resistance:340kΩ Tolerance:±0.5% Tolerance:±0.5% Power(Watts):250mW Voltage-Supply(Max):200V Temperature Coefficient:±25ppm/℃ Temperature Coefficient:±25ppm/℃ Operating Temperature:-55℃~+155℃ Operating Temperature:-55℃~+155℃; LCSC Part Name: 薄膜电阻 340kΩ ±0.5% 250mW; Supplier Part: C5137142; Manufacturer: Viking(光颉); Supplier Footprint: 1206; JLCPCB Part Class: Extended Part; Datasheet: https://item.szlcsc.com/datasheet/ARG06DTC3403/5745805.html; Supplier: LCSC; Type: Thin Film Resistor; Tolerance: ±0.5%; Power(Watts): 250mW; Voltage-Supply(Max): 200V; Temperature Coefficient: ±25ppm/℃; Operating Temperature: -55℃~+155℃
R34 R35 = SCR1206F12K7: Type:Thick Film Resistor Resistance:12.7kΩ Tolerance:±1% Tolerance:±1% Power(Watts):250mW Voltage-Supply(Max):200V Operating Temperature:-55℃~+155℃ Operating Temperature:-55℃~+155℃; LCSC Part Name: 厚膜电阻 12.7kΩ ±1% 250mW; Supplier Part: C3017315; Manufacturer: VO(翔胜); Supplier Footprint: 1206; JLCPCB Part Class: Extended Part; Datasheet: https://atta.szlcsc.com/upload/public/pdf/source/20220513/247AF9639BA21CF93567DC289CCC6A22.pdf; Supplier: LCSC; Type: Thick Film Resistor; Tolerance: ±1%; Power(Watts): 250mW; Voltage-Supply(Max): 200V; Operating Temperature: -55℃~+155℃
R39 = FRC1206F1005TS: Type:Thick Film Resistor Resistance:10MΩ Tolerance:±1% Tolerance:±1% Power(Watts):250mW Voltage-Supply(Max):200V Temperature Coefficient:±100ppm/℃ Temperature Coefficient:±100ppm/℃ Operating Temperature:-55℃~+155℃ Operating Temperature:-55℃~+155℃; LCSC Part Name: 10MΩ ±1% 250mW 厚膜电阻; Supplier Part: C2933576; Manufacturer: FOJAN(富捷); Supplier Footprint: 1206; JLCPCB Part Class: Extended Part; Datasheet: https://item.szlcsc.com/datasheet/FRC1206F1005TS/3279678.html; Supplier: LCSC; Type: Thick Film Resistor; Tolerance: ±1%; Power(Watts): 250mW; Voltage-Supply(Max): 200V; Temperature Coefficient: ±100ppm/℃; Operating Temperature: -55℃~+155℃
RN1 = 4D03WGJ0103T5E: Number of Resistors: Resistance:10kΩ Tolerance:±5% Tolerance:±5% Power(Watts): Temperature Coefficient:±200ppm/℃ Temperature Coefficient:±200ppm/℃ Number of Pins:; LCSC Part Name: 10kΩ ±5%; Supplier Part: C29718; Manufacturer: UNI-ROYAL(厚声); Supplier Footprint: 0603x4; JLCPCB Part Class: Basic Part; Datasheet: https://atta.szlcsc.com/upload/public/pdf/source/20191224/C474318_2527498AE30E813171187CCD28401A71.pdf; Supplier: LCSC; Tolerance: ±5%; Temperature Coefficient: ±200ppm/℃
U1 = APT2012LZGCK: Illumination Color:Emerald Green Voltage - Forward(Vf):2.65V Voltage - Forward(Vf):2.65V Forward Current:2mA Wavelength - Dominant:525nm Wavelength - Dominant:525nm Peak Wavelength:515nm Lens Color:Water Clear Luminous Intensity:50mcd Luminous Intensity:5; Supplier Part: C5569446; Manufacturer: Kingbright; Supplier Footprint: 0805; JLCPCB Part Class: Extended Part; Datasheet: https://item.szlcsc.com/datasheet/APT2012LZGCK/6487820.html; Supplier: LCSC; Illumination Color: Emerald Green; Voltage - Forward(Vf): 2.65V; Forward Current: 2mA; Wavelength - Dominant: 525nm; Peak Wavelength: 515nm; Lens Color: Water Clear; Luminous Intensity: 50mcd
U2 = TPSM863252RDXR: Function:Buck Number of Outputs:1 Voltage - Supply:3V~17V Voltage - Supply:3V~17V Output Voltage Accuracy:±1.5% Output Voltage Accuracy:±1.5% Output Voltage:600mV~10V Output Voltage:600mV~10V Output Current(Max):3A Output Current(Max):3A Supply Current (I; Supplier Part: C19632640; Manufacturer: TI(德州仪器); Supplier Footprint: QFN-FCMOD-7(3.3x4); JLCPCB Part Class: Extended Part; Datasheet: https://www.ti.com.cn/cn/lit/ds/symlink/tpsm863252.pdf?ts=1738739465848&ref_url=https%253A%252F%252Fwww.ti.com.cn%252Fsitesearch%252Fzh-cn%252Fdocs%252Funiversalsearch.tsp%253FlangPref%253Dzh-CN%2526nr%253D12%2526searchTerm%253DTPSM863252RDXR; Supplier: LCSC; Function: Buck; Number of Outputs: 1; Voltage - Supply: 3V~17V; Output Voltage Accuracy: ±1.5%; Output Voltage: 600mV~10V; Output Current(Max): 3A; Supply Current (Iq): 100uA; Switching Frequency: 1.2MHz; Ripple Noise: 20mVp-p; Features: Over Current Protection；Over Voltage Protection；Under Voltage Protection；Over Temperature Protection; Length: 4mm; Width: 3.3mm; Height: 2mm; Operating Temperature Range: -40℃~+125℃
U3 = LM74800QDRRRQ1: Maximum Continuous Current:2.6A Voltage - Supply:3V~65V Voltage - Supply:3V~65V Operating Temperature	-:-40℃~+125℃ Operating Temperature	-:-40℃~+125℃; Supplier Part: C3215600; Manufacturer: TI(德州仪器); Supplier Footprint: SON-12(3x3); JLCPCB Part Class: Extended Part; Datasheet: https://www.ti.com/cn/lit/gpn/lm7480-q1; Supplier: LCSC; Maximum Continuous Current: 2.6A; Voltage - Supply: 3V~65V; Operating Temperature	-: -40℃~+125℃
U4 = CRCW0402261KFKED: Type:Thick Film Resistors Resistance: Tolerance:±1% Tolerance:±1% Power(Watts): Overload Voltage (Max): Temperature Coefficient:±100ppm/℃ Temperature Coefficient:±100ppm/℃ Operating Temperature:-55℃~+155℃ Operating Temperature:-55℃~+155℃; LCSC Part Name: 厚膜电阻 261kΩ ±1% 62.5mW; Supplier Part: C2076807; Manufacturer: VISHAY(威世); Supplier Footprint: 0402; JLCPCB Part Class: Extended Part; Datasheet: https://atta.szlcsc.com/upload/public/pdf/source/20210503/4CAD3FA9B4C9A749933C1C52DBF827C2.pdf; Supplier: LCSC; Type: Thick Film Resistors; Tolerance: ±1%; Temperature Coefficient: ±100ppm/℃; Operating Temperature: -55℃~+155℃
U5 = LM5161PWPR: Function:Step-down type Output Type:Adjustable Input Voltage:4.5V~100V Input Voltage:4.5V~100V Output Voltage:2V~92V Output Voltage:2V~92V Output Current:1A Switching Frequency:1MHz Switching Frequency:1MHz Operating Temperature:-40℃~+125℃@(TJ) Operating; LCSC Part Name: 100V 1A 同步降压转换器; Supplier Part: C468246; Manufacturer: TI(德州仪器); Supplier Footprint: HTSSOP-14-EP; JLCPCB Part Class: Extended Part; Datasheet: https://www.ti.com/cn/lit/gpn/lm5161; Supplier: LCSC; Function: Step-down type; Output Type: Adjustable; Input Voltage: 4.5V~100V; Output Voltage: 2V~92V; Output Current: 1A; Switching Frequency: 1MHz; Operating Temperature: -40℃~+125℃@(TJ); Synchronous Rectification: Yes; Number of Outputs: 1; Topology: Step-down；Flyback; Switch tube (built-in/external): Built-in
U6 = ESP32-S3-WROOM-1U-N8R8: LCSC Part Name: 通用型Wi-Fi+低功耗蓝牙MCU模组; Supplier Part: C2980300; Manufacturer: ESPRESSIF(乐鑫); Supplier Footprint: SMD,18x19.2mm; JLCPCB Part Class: Extended Part; Datasheet: https://item.szlcsc.com/datasheet/ESP32-S3-WROOM-1U-N8R8/3401552.html; Supplier: LCSC
U7 = MKDV8GIL-AST: Memory Size:8Gbit Clock Frequency:50MHz Voltage - Supply:2.7V~3.6V Voltage - Supply:2.7V~3.6V Write Cycle Time(tWC):- Page Program time (TPP):- Block Erase Time(tBE):- Data Retention - TDR (Year):- Operating Temperature:-40℃~+85℃ Operating Temperature:-40; LCSC Part Name: 8Gb SD NAND  SDNAND工业级宽温 SLC; Supplier Part: C26159627; Manufacturer: MK(米客方德); Supplier Footprint: LGA-8(6x8); JLCPCB Part Class: Extended Part; Datasheet: https://atta.szlcsc.com/upload/public/pdf/source/20240705/6522E9CE94E018BF06A2CACAEEC15C56.pdf; Supplier: LCSC; Memory Size: 8Gbit; Clock Frequency: 50MHz; Voltage - Supply: 2.7V~3.6V; Operating Temperature: -40℃~+85℃; Interface: SD2.0
U9 U10 = BSS138_C5250986: Supplier Part: C5250986; Manufacturer: TWGMC(台湾迪嘉); Supplier Footprint: SOT-23; JLCPCB Part Class: Extended Part; Datasheet: https://atta.szlcsc.com/upload/public/pdf/source/20221109/9ADA114E38717C662A3131D5642C5082.pdf; Supplier: LCSC
U11 U12 = TD-1183SN-1.7H-250: LCSC Part Name: 小型正按轻触开关无柱 250gf H1.8; Supplier Part: C2905195; Manufacturer: DEALON(德艺隆); Supplier Footprint: SMD,2.5x3mm; JLCPCB Part Class: Extended Part; Datasheet: https://atta.szlcsc.com/upload/public/pdf/source/20220901/31B45DB5661394D4632E3F23E0E23353.pdf; Supplier: LCSC
U13 U14 = ACS781LLRTR-100B-T: Current Range:100A Current Range:100A Supply Voltage:3V~3.6V Supply Voltage:3V~3.6V Sensitivity:13.2mV/A Operating Temperature:-40℃~+150℃ Operating Temperature:-40℃~+150℃; LCSC Part Name: 集成电路/电流霍尔芯片; Supplier Part: C459345; Manufacturer: ALLEGRO(美国埃戈罗); Supplier Footprint: PSOF-7; JLCPCB Part Class: Extended Part; Datasheet: https://atta.szlcsc.com/upload/public/pdf/source/20191122/C459345_94FAB92827FCBE2B10CEE0837564D725.pdf; Supplier: LCSC; Current Range: 100A; Supply Voltage: 3V~3.6V; Sensitivity: 13.2mV/A; Operating Temperature: -40℃~+150℃
U15 = DS18B20U-MS: Supplier Part: C22360666; Manufacturer: MSKSEMI(美森科); Supplier Footprint: MSOP-8; JLCPCB Part Class: Extended Part; Datasheet: https://atta.szlcsc.com/upload/public/pdf/source/20240508/6DE6BC45C23643D52EBCC34E588D5884.pdf; Supplier: LCSC
U18 = LTC4355IDE#PBF: Type:Ideal Diode Number of Channels:2 Control Input Logic:Active High Voltage - Supply:9V~80V Voltage - Supply:9V~80V Operating Temperature	-:-40℃~+85℃ Operating Temperature	-:-40℃~+85℃; LCSC Part Name: 具输入电源和熔丝监视器的正高电压理想二极管“或”控制器; Supplier Part: C688210; Manufacturer: ADI(亚德诺); Supplier Footprint: DFN-14-EP(3x4); JLCPCB Part Class: Extended Part; Datasheet: https://item.szlcsc.com/datasheet/LTC4355IDE%2523PBF/718918.html; Supplier: LCSC; Type: Ideal Diode; Number of Channels: 2; Control Input Logic: Active High; Voltage - Supply: 9V~80V; Operating Temperature	-: -40℃~+85℃
U19 U20 = SCT1032T6.3A250V: Current Rating:6.3A Rated Voltage(DC):- Features:- Rated voltage AC:- size:- Rated voltage:250V Breaking ability:100A@250VAC,1000A@125V Fusing characteristics:Slow Break working temperature:-55°C-125°C series:SCT1032; LCSC Part Name: SET(赛尔特) SMD贴片保险丝 SCT1032 5A 250V/125V 慢断 1个; Supplier Part: C19712567; Manufacturer: SET(赛尔特); Supplier Footprint: SMD,10.3x3.3mm; JLCPCB Part Class: Extended Part; Datasheet: https://item.szlcsc.com/datasheet/SCT1032T6.3A250V/21025116.html; Supplier: LCSC; Current Rating: 6.3A; Rated voltage: 250V; Breaking ability: 100A@250VAC,1000A@125V; Fusing characteristics: Slow Break; working temperature: -55°C-125°C; series: SCT1032
U22 = CH340K: Applications Function:USB to serial Protocol:USB 2.0 Number of Channels:- Voltage - Supply:3.3V；5V Voltage - Supply:3.3V；5V Data Rate:2Mbps Operating Temperature:-20℃~+70℃ Operating Temperature:-20℃~+70℃; LCSC Part Name: USB转串口芯片CH340; Supplier Part: C968586; Manufacturer: WCH(南京沁恒); Supplier Footprint: ESSOP-10-150mil-1mm; JLCPCB Part Class: Extended Part; Datasheet: https://atta.szlcsc.com/upload/public/pdf/source/20240313/C21A12AB66F63ABF8F8743FF13A35C95.pdf; Supplier: LCSC; Applications Function: USB to serial; Protocol: USB 2.0; Voltage - Supply: 3.3V；5V; Data Rate: 2Mbps; Operating Temperature: -20℃~+70℃
